# Altium project Solari Cifra 5 - G031.PrjPcb
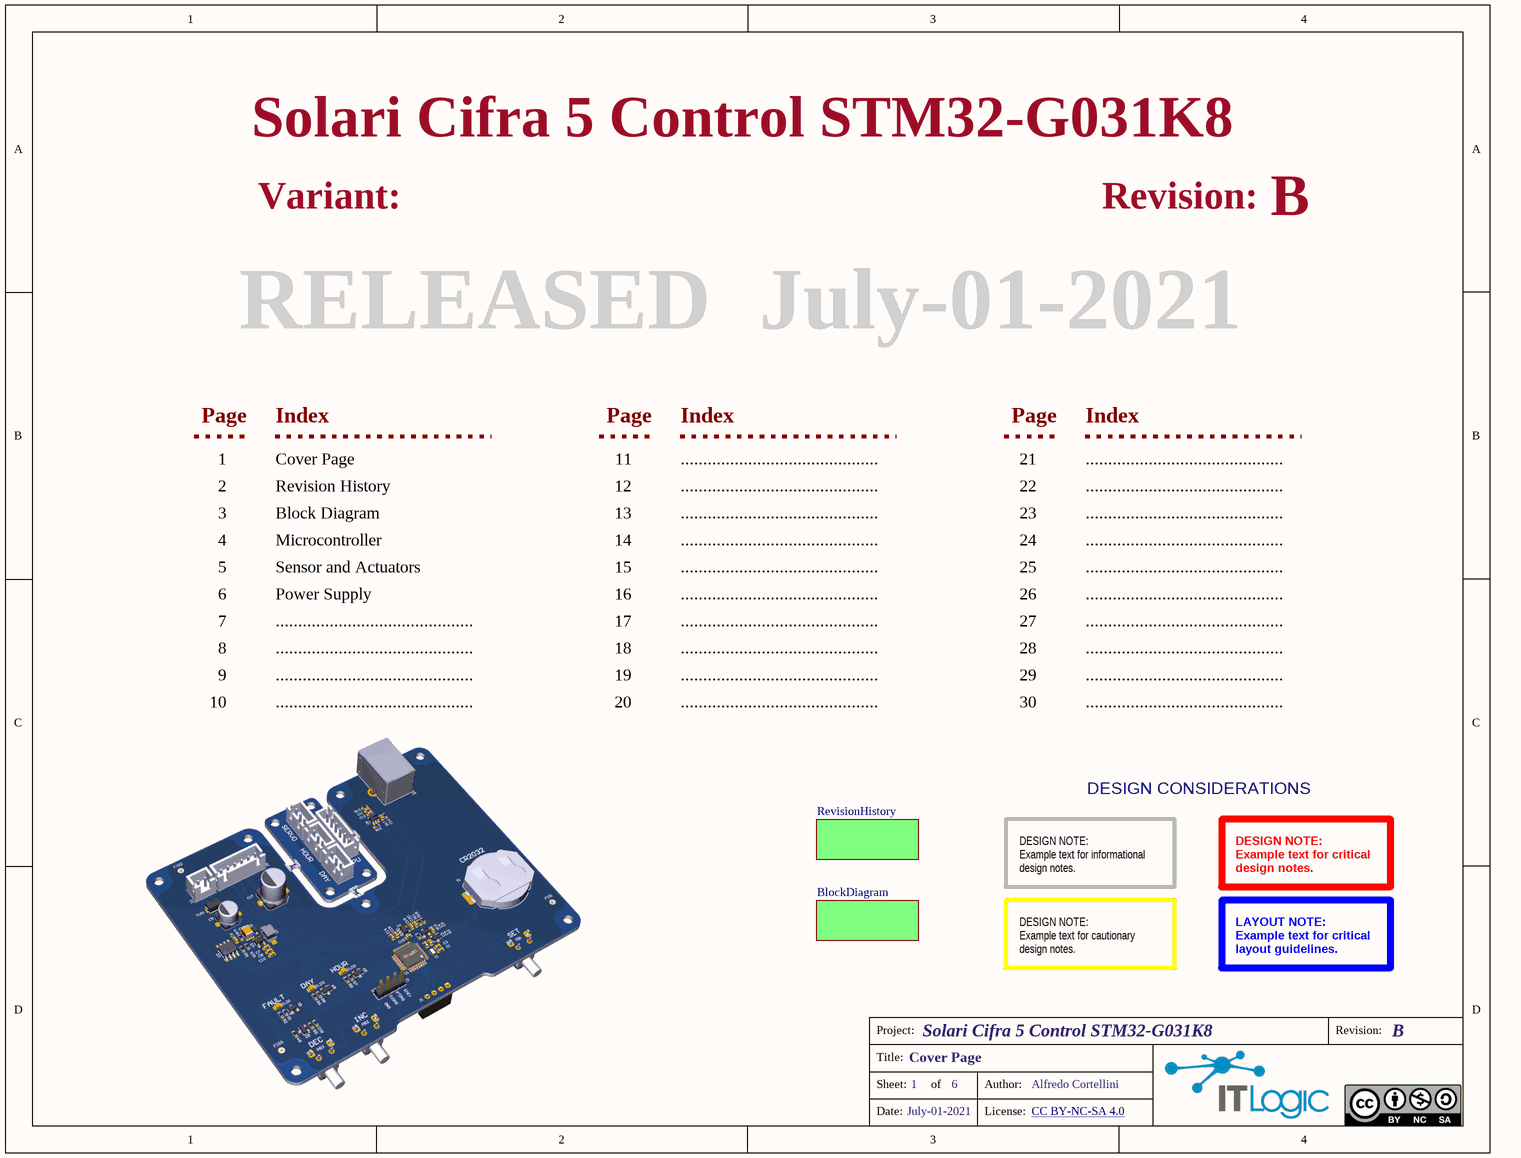
[diagram p0: Cover Page.SchDoc]
VersionRevision: B; ReleaseDate: July-01-2021; ProjectTitle: Solari Cifra 5 Control STM32-G031K8; ProjectCode: SOLC5-G031-B; ProjectAuthor: Alfredo Cortellini
6 sheets, 106 parts. Net scope: flat (ports and power ports of the same name join across sheets).
Board files: PANEL.PcbDoc, SOLC5-G031.PcbDoc
Sheets:
  Cover Page.SchDoc
    RevisionHistory = Revision History.SchDoc
    BlockDiagram = Block Diagram.SchDoc
      Power Supply = Power Supply.SchDoc
      Sensors and Actuators = Sensors and Actuators.SchDoc
      Microcontroller = Microcontroller.SchDoc

## Sheet Cover Page.SchDoc: Cover Page
size Letter; Organization: IT Logic; Address1: 5753 Highway 85 N; Address2: Crestview, FL 32536; Address3: United States; DocumentNumber: 1; SheetNumber: 1; SheetTotal: 6; Email: pcb-design@itlogic.cloud

### Sub-sheets
BlockDiagram = Block Diagram.SchDoc: no entries
RevisionHistory = Revision History.SchDoc: no entries

### Notes on the sheet
- Variant:
- Revision:
- RELEASED
- Page
- Index
- 1
- 2
- Cover Page
- Revision History
- 11
- 12
- ............................................
- 21
- 22
- 3
- 4
- 5
- Microcontroller
- Sensor and Actuators
- Block Diagram
- 13
- 14
- 15
- 23
- 24
- 25
- 6
- 7
- Power Supply
- 16
- 17
- 26
- 27
- 8
- 9
- 10
- 18
- 19
- 20
- 28
- 29
- 30
- DESIGN CONSIDERATIONS
- DESIGN NOTE:
  Example text for informational
  design notes.
- DESIGN NOTE:
  Example text for critical
  design notes.
- DESIGN NOTE:
  Example text for cautionary
  design notes.
- LAYOUT NOTE:
  Example text for critical
  layout guidelines.
- Project:
- Title:
- Sheet:
- of
- Author:
- Date:
- License:
- CC BY-NC-SA 4.0 <https://creativecommons.org/licenses/by-nc-sa/4.0/>

## Sheet Revision History.SchDoc: Revision History
size Letter; Author: Alfredo Cortellini; Organization: IT Logic; Address1: 5753 Highway 85 N; Address2: Crestview, FL 32536; Address3: United States; DocumentNumber: 2; SheetNumber: 2; SheetTotal: 6; Email: pcb-design@itlogic.cloud
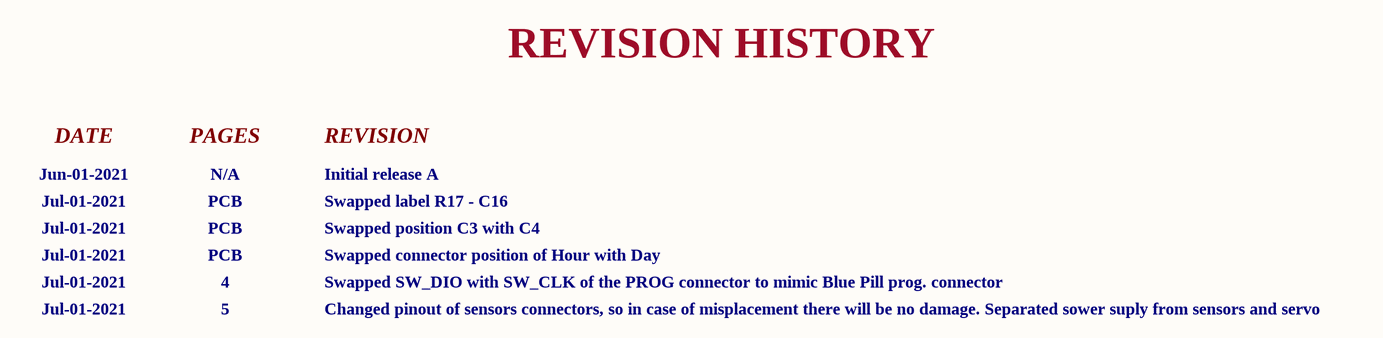
[diagram p1: Revision History.SchDoc]

### Notes on the sheet
- REVISION HISTORY
- Jun-01-2021
- DATE
- N/A
- PAGES
- Initial release A
- REVISION
- Jul-01-2021
- PCB
- Swapped label R17 - C16
- Swapped position C3 with C4
- 4
- 5
- Swapped connector position of Hour with Day
- Swapped SW_DIO with SW_CLK of the PROG connector to mimic Blue Pill prog. connector
- Changed pinout of sensors connectors, so in case of misplacement there will be no damage. Separated sower suply from sensors and servo
- Project:
- Revision:
- Title:
- Sheet:
- of
- Author:
- Date:
- License:
- CC BY-NC-SA 4.0 <https://creativecommons.org/licenses/by-nc-sa/4.0/>

## Sheet Block Diagram.SchDoc: Block Diagram
size Letter; Author: Alfredo Cortellini; Organization: IT Logic; Address1: 5753 Highway 85 N; Address2: Crestview, FL 32536; Address3: United States; DocumentNumber: 3; SheetNumber: 3; SheetTotal: 6; Email: pcb-design@itlogic.cloud
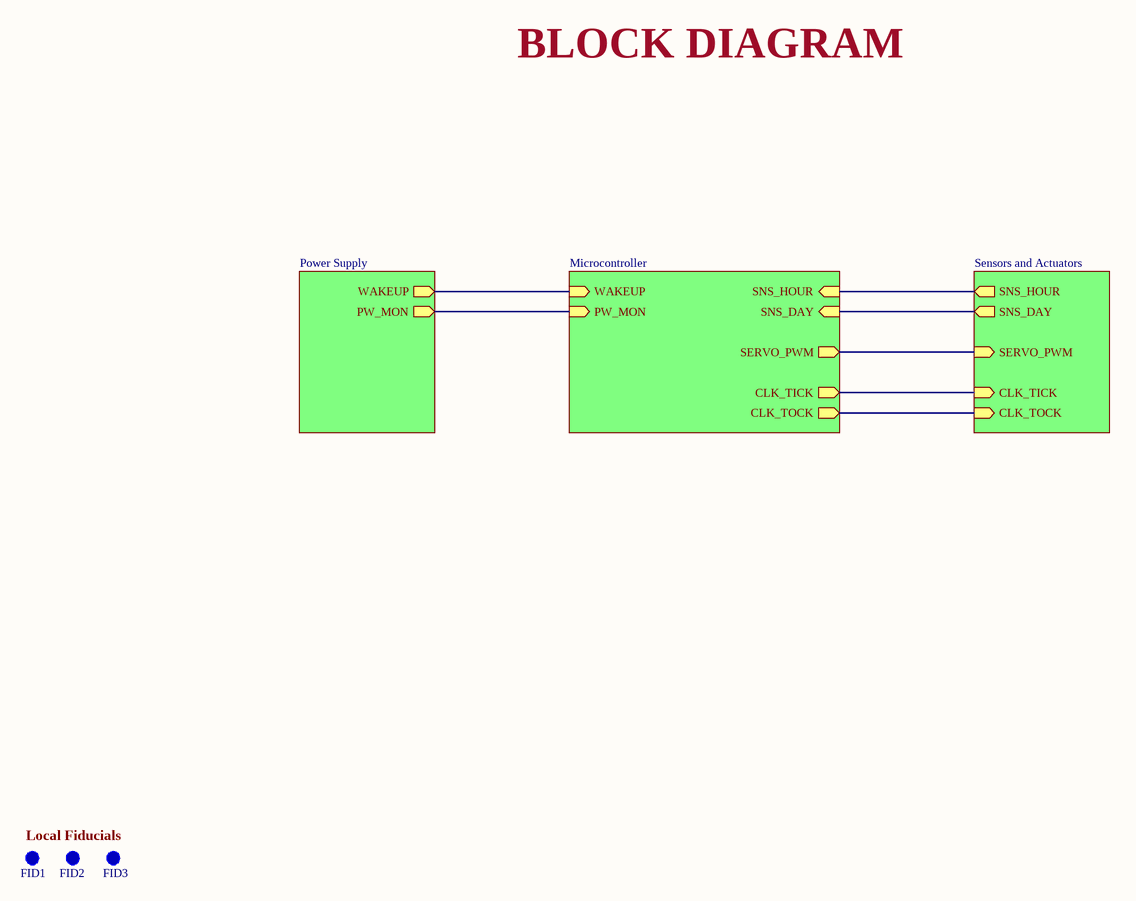
[diagram p2: Block Diagram.SchDoc]

### Parts
FID1  Local Fiducial  [FID-1-2MM]  (value not drawn)
FID2  Local Fiducial  [FID-1-2MM]  (value not drawn)
FID3  Local Fiducial  [FID-1-2MM]  (value not drawn)

### Sub-sheets
Microcontroller = Microcontroller.SchDoc: SNS_HOUR (in), SNS_DAY (in), SERVO_PWM (out), CLK_TICK (out), CLK_TOCK (out), WAKEUP (in), PW_MON (in)
Power Supply = Power Supply.SchDoc: WAKEUP (out), PW_MON (out)
Sensors and Actuators = Sensors and Actuators.SchDoc: SNS_HOUR (out), SNS_DAY (out), SERVO_PWM (in), CLK_TICK (in), CLK_TOCK (in)

### Nets
(unnamed): sheet Power Supply/WAKEUP, sheet Microcontroller/WAKEUP
(unnamed): sheet Power Supply/PW_MON, sheet Microcontroller/PW_MON
(unnamed): sheet Sensors and Actuators/SNS_HOUR, sheet Microcontroller/SNS_HOUR
(unnamed): sheet Sensors and Actuators/SNS_DAY, sheet Microcontroller/SNS_DAY
(unnamed): sheet Sensors and Actuators/SERVO_PWM, sheet Microcontroller/SERVO_PWM
(unnamed): sheet Sensors and Actuators/CLK_TICK, sheet Microcontroller/CLK_TICK
(unnamed): sheet Sensors and Actuators/CLK_TOCK, sheet Microcontroller/CLK_TOCK

### Notes on the sheet
- BLOCK DIAGRAM
- Local Fiducials
- Project:
- Revision:
- Title:
- Sheet:
- of
- Author:
- Date:
- License:
- CC BY-NC-SA 4.0 <https://creativecommons.org/licenses/by-nc-sa/4.0/>

### Library data of the parts
FID1-FID3 = FID-1-2MM: Fiducial 1.0mm Diameter, 2.0mmil Mask

## Sheet Power Supply.SchDoc: Power Supply
size Letter; Author: Alfredo Cortellini; Organization: IT Logic; Address1: 5753 Highway 85 N; Address2: Crestview, FL 32536; Address3: United States; DocumentNumber: 6; SheetNumber: 6; SheetTotal: 6; Email: pcb-design@itlogic.cloud
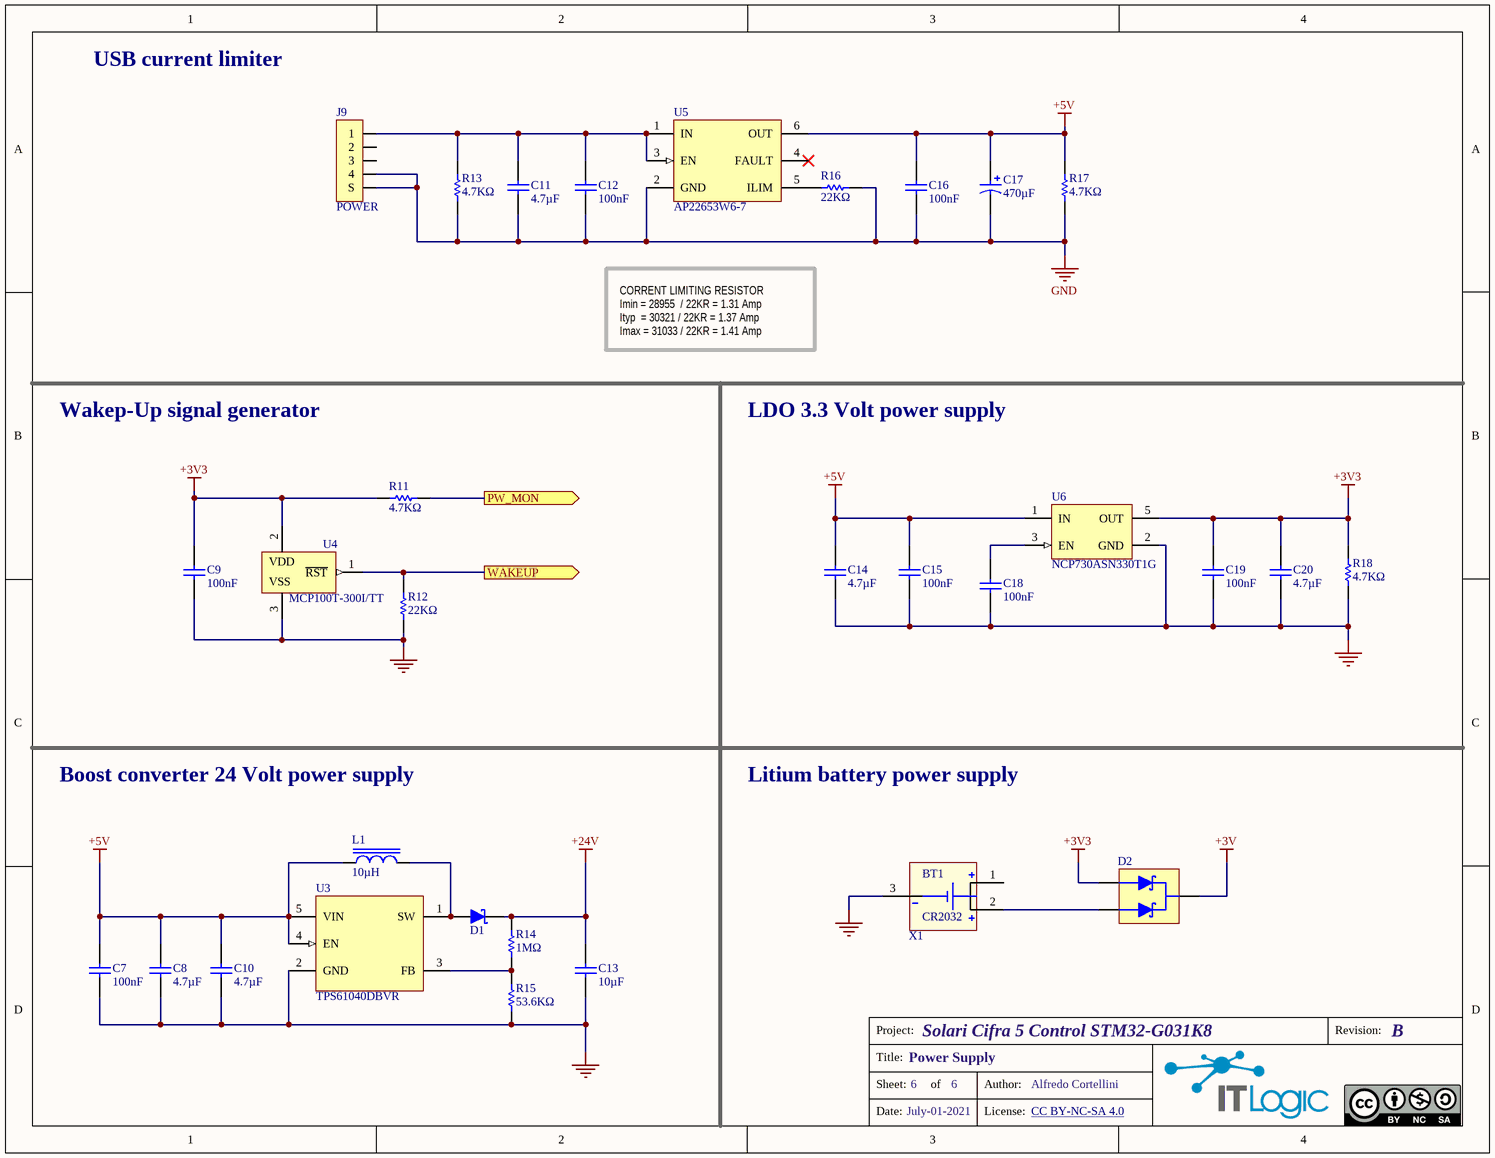
[diagram p3: Power Supply.SchDoc]

### Parts
BT1  CR2032  (mechanical)
C7  100nF  [C0603-H90]
C8  4.7µF  [C0603-H90]
C9  100nF  [C0603-H90]
C10  4.7µF  [C0603-H90]
C11  4.7µF  [C0603-H90]
C12  100nF  [C0603-H90]
C13  10µF  [C1210-H250]
C14  4.7µF  [C0603-H90]
C15  100nF  [C0603-H90]
C16  100nF  [C0603-H90]
C17  470µF  [C-AE-D8-H102]
C18  100nF  [C0603-H90]
C19  100nF  [C0603-H90]
C20  4.7µF  [C0603-H90]
D1  ZLLS400QTC  [SOD-323]  (value not drawn)
D2  BAT5405E6327HTSA1  [SOT-23]  (value not drawn)
J9  POWER  [67068-8000]
L1  10µH  [IND-LQH43CN]
R11  4.7KΩ  [R0603-H55]
R12  22KΩ  [R0603-H55]
R13  4.7KΩ  [R0603-H55]
R14  1MΩ  [R0603-H55]
R15  53.6KΩ  [R0603-H55]
R16  22KΩ  [R0603-H55]
R17  4.7KΩ  [R0603-H55]
R18  4.7KΩ  [R0603-H55]
U3  TPS61040DBVR  [SOT-235]
U4  MCP100T-300I/TT  [SOT-23]
U5  AP22653W6-7  [SOT-236]
U6  NCP730ASN330T1G  [SOT-235]
X1  BAT-HLD-001  [BATT-TRAY-2032]  (value not drawn)

### Ports
PW_MON (out), WAKEUP (out)

### Nets
+3V: D2.3(K)
+3V3: C9.2 C19.2 C20.2 D2.1(A) R11.2 R18.2 U4.2(VDD) U6.5(OUT)
+5V: C7.2 C8.2 C10.2 C14.2 C15.2 C16.2 C17.1 L1.1 R17.2 U3.4(EN) U3.5(VIN) U5.6(OUT) U6.1(IN)
+24V: C13.2 D1.1(K) R14.2
GND: C7.1 C8.1 C9.1 C10.1 C11.1 C12.1 C13.1 C14.1 C15.1 C16.1 C17.2 C18.1 C19.1 C20.1 J9.4 J9.S R12.1 R13.1 R15.1 R16.2 R17.1 R18.1 U3.2(GND) U4.3(VSS) U5.2(GND) U6.2(GND) X1.3(-)
NetC11_2: C11.2 C12.2 J9.1 R13.2 U5.1(IN) U5.3(EN)
NetC18_2: C18.2 U6.3(EN)
NetD1_2: D1.2(A) L1.2 U3.1(SW)
NetD2_2: D2.2(A) X1.2(+)
NetR11_1: R11.1 ; port PW_MON
NetR12_2: R12.2 U4.1(~{RST}) ; port WAKEUP
NetR14_1: R14.1 R15.2 U3.3(FB)
NetR16_1: R16.1 U5.5(ILIM)

Not connected (* = marked no-connect by the designer): J9 2 3; U5 4(FAULT)*; X1 1(+)

### Notes on the sheet
- USB current limiter
- CORRENT LIMITING RESISTOR
  Imin = 28955  / 22KR = 1.31 Amp
  Ityp  = 30321 / 22KR = 1.37 Amp
  Imax = 31033 / 22KR = 1.41 Amp
- Wakep-Up signal generator
- LDO 3.3 Volt power supply
- Boost converter 24 Volt power supply
- Litium battery power supply
- Project:
- Revision:
- Title:
- Sheet:
- of
- Author:
- Date:
- License:
- CC BY-NC-SA 4.0 <https://creativecommons.org/licenses/by-nc-sa/4.0/>

### Library data of the parts
BT1 = CR2032: Battery Lithium 3V Coin 20mm; Manufacturer: Panasonic BSG; Manufacturer Part Number: CR2032; Mount: Free Hanging; Voltage Rating: 3V; ComponentLink1URL: https://datasheet.ciiva.com/2/crseries-datasheets-merged-2903.pdf; ComponentLink1Description: Data Sheet
C7 C9 C12 C15 C16 C18 C19 = CGA3E2X7R1H104K080AA: Cap 0603 Case Ceramic 100nF 50V X7R; Manufacturer: TDK; Value: 100n; Manufacturer Part Number: CGA3E2X7R1H104K080AA; Mount: Surface Mount; Case: 0603; Capacitance: 100nF; Dielectric: X7R; Voltage Rating: 50V; ComponentLink1URL: https://product.tdk.com/system/files/dam/doc/product/capacitor/ceramic/mlcc/catalog/mlcc_commercial_general_en.pdf; ComponentLink1Description: Data Sheet
C8 C10 C11 C14 C20 = C1608X7S1A475K080AC: Cap 0603 Case Ceramic 4.7uF 10V X7S; Manufacturer: TDK; Voltage Rating: 50V; Value: 4.7u; Manufacturer Part Number: C1608X7S1A475K080AC; Mount: Surface Mount; Case: 0603; Capacitance: 4.7uF; Dielectric: X7S; ComponentLink1URL: https://product.tdk.com/system/files/dam/doc/product/capacitor/ceramic/mlcc/catalog/mlcc_commercial_general_en.pdf; ComponentLink1Description: Data Sheet
C13 = CL32B106KBJNNWE: Cap 1210 Case Ceramic 10uF 50V X7R 10%; Manufacturer: Samsung; Dielectric: X7S; Value: 10u; Manufacturer Part Number: CL32B106KBJNNWE; Mount: Surface Mount; Case: 1210; Capacitance: 10uF; Voltage Rating: 50V; ComponentLink1URL: https://www.mouser.com/datasheet/2/585/MLCC-1837944.pdf; ComponentLink1Description: Data Sheet
C17 = EEE-FK1C471P: Cap Electrolytic Alu 470uF 16V 20% (10 X 10.2mm) SMD 600mA 2000h 105C Automotive T/R; Manufacturer: Panasonic; Resistance: 0.16R; Value: 470u; Manufacturer Part Number: EEE-FK1C471P; Mount: Surface Mount; Capacitance: 470uF; Voltage Rating: 16V; ComponentLink1URL: https://datasheet.ciiva.com/3773/41677623s8437994n1386-3773397.pdf; ComponentLink1Description: Data Sheet; Case: F
D1 = ZLLS400QTC: Diode Schottky 40V 0.5A, Vf 480mV, 2-Pin SOD323; Manufacturer: Diodes Incorporated; Manufacturer Part Number: ZLLS400QTC; Mount: Surface Mount; Case: SOD323; Current Rating: 0.5A; ComponentLink1URL: https://eu.mouser.com/datasheet/2/115/ZLLS400Q-959647.pdf; ComponentLink1Description: Data Sheet
D2 = BAT5405E6327HTSA1: Diode Schottky, Common cathode, 40V 0.3A 3-Pin SOT-323; Manufacturer: Infineon Technologies; Manufacturer Part Number: BAT5405E6327HTSA1; Mount: Surface Mount; Case: SOT-23; Current Rating: 0.3A; ComponentLink1URL: https://www.infineon.com/dgdl/Infineon-BAT54SERIES-DS-v01_01-en.pdf?fileId=db3a304314dca3890115190b74210ea6; ComponentLink1Description: Data Sheet
J9 = 67068-8000: Conn USB Type B Right-Angle, Kinked Solder Tabs; Manufacturer: Molex; Voltage Rating: 30V; Current Rating: 1.5A; Manufacturer Part Number: 67068-8000; Mount: Through Hole; ComponentLink1URL: https://www.molex.com/pdm_docs/sd/670688000_sd.pdf; ComponentLink1Description: Data Sheet
L1 = LQH43CN100K03L: Inductor Power LQH43CN Series, 10uH, 0.65 A, 0.24 ohm, SMD; Manufacturer: Murata; Value: 10u; Manufacturer Part Number: LQH43CN100K03L; Inductance: 10µH; ComponentLink1URL: https://search.murata.co.jp/Ceramy/image/img/P02/JELF243A-0042.pdf; ComponentLink1Description: Data Sheet; Mount: Surface Mount
R11 R13 R17 R18 = RC0603FR-074K7L: Resistor 0603 Case 4.7KR 1% 1/10W; Manufacturer: Yageo; Voltage Rating: 150V; Value: 4.7K; Manufacturer Part Number: RC0603FR-074K7L; Case: 0603; Resistance: 4.7kR; ComponentLink1URL: https://datasheet.ciiva.com/11808/0900766b8106beab-11808155.pdf; ComponentLink1Description: Data Sheet; Mount: Surface Mount
R12 R16 = RC0603FR-0722KL: Resistor 0603 Case 22KR 1% 1/10W; Manufacturer: Yageo; Voltage Rating: 150V; Value: 22K; Manufacturer Part Number: RC0603FR-0722KL; Case: 0603; Resistance: 22kR; ComponentLink1URL: https://datasheet.ciiva.com/2457/pyu-r-int-thick-7-2457521.pdf; ComponentLink1Description: Data Sheet; Mount: Surface Mount
R14 = RC0603FR-071ML: Resistor 0603 Case 1MR 1% 1/10W; Manufacturer: Yageo; Voltage Rating: 150V; Value: 1M; Manufacturer Part Number: RC0603FR-071ML; Case: 0603; Resistance: 1MR; ComponentLink1URL: https://datasheet.ciiva.com/2519/pyu-r-int-thick-7-2519712.pdf; ComponentLink1Description: Data Sheet; Mount: Surface Mount
R15 = RC0603FR-0753K6L: Resistor 0603 Case 53.6KR 1% 1/10W; Manufacturer: Yageo; Voltage Rating: 150V; Value: 53.6K; Manufacturer Part Number: RC0603FR-0753K6L; Case: 0603; Resistance: 53.6kR; ComponentLink1URL: https://datasheet.ciiva.com/2457/pyu-r-int-thick-7-2457521.pdf; ComponentLink1Description: Data Sheet; Mount: Surface Mount
U3 = TPS61040DBVR: Conv DC-DC Sync Step-Up 28V .45A 1MHz SOT-23-5; Manufacturer: Texas Instruments; Manufacturer Part Number: TPS61040DBVR; Mount: Surface Mount; Case: STO-235; ComponentLink1URL: http://www.ti.com/lit/ds/symlink/tps54308.pdf; ComponentLink1Description: Data Sheet
U4 = MCP100T-300I/TT: Power Supervisor 3.00V Low SOT23; Manufacturer: Microchip; Manufacturer Part Number: MCP100T-300I/TT; Mount: Surface Mount; Case: SOT-23-3; ComponentLink1URL: https://ww1.microchip.com/downloads/en/DeviceDoc/11187f.pdf; ComponentLink1Description: Data Sheet
U5 = AP22653W6-7: Smart High-Side Power Distribution Switches, 1 Output, 5.5V, Adjustable current limit 2.1A Max, Rdson 65mΩ, SOT-23-6; Manufacturer: Diodes Incorporated; Manufacturer Part Number: AP22653W6-7; Mount: Surface Mount; Case: SOT-23-6; ComponentLink1URL: https://www.diodes.com/assets/Datasheets/AP22652_53_52A_53A.pdf; ComponentLink1Description: Data Sheet
U6 = NCP730ASN330T1G: LDO 3.3V 150mA Out  38Vin 290mV Dropout, Quiescent current 1 uA SOT-23-5; Manufacturer: ON Semiconductor; Manufacturer Part Number: NCP730ASN330T1G; Mount: Surface Mount; Case: SOT-23-5; ComponentLink1URL: https://eu.mouser.com/datasheet/2/308/1/NCP730_D-2317345.pdf; ComponentLink1Description: Data Sheet
X1 = BAT-HLD-001: Holder Battery Coin 20mm; Manufacturer: Linx; Manufacturer Part Number: BAT-HLD-001; Mount: Surface Mount; ComponentLink1URL: https://datasheet.ciiva.com/4/bat-hld-001-4035.pdf; ComponentLink1Description: Data Sheet

## Sheet Sensors and Actuators.SchDoc: Sensors and Actuators
size Letter; Author: Alfredo Cortellini; Organization: IT Logic; Address1: 5753 Highway 85 N; Address2: Crestview, FL 32536; Address3: United States; DocumentNumber: 5; SheetNumber: 5; SheetTotal: 6; Email: pcb-design@itlogic.cloud
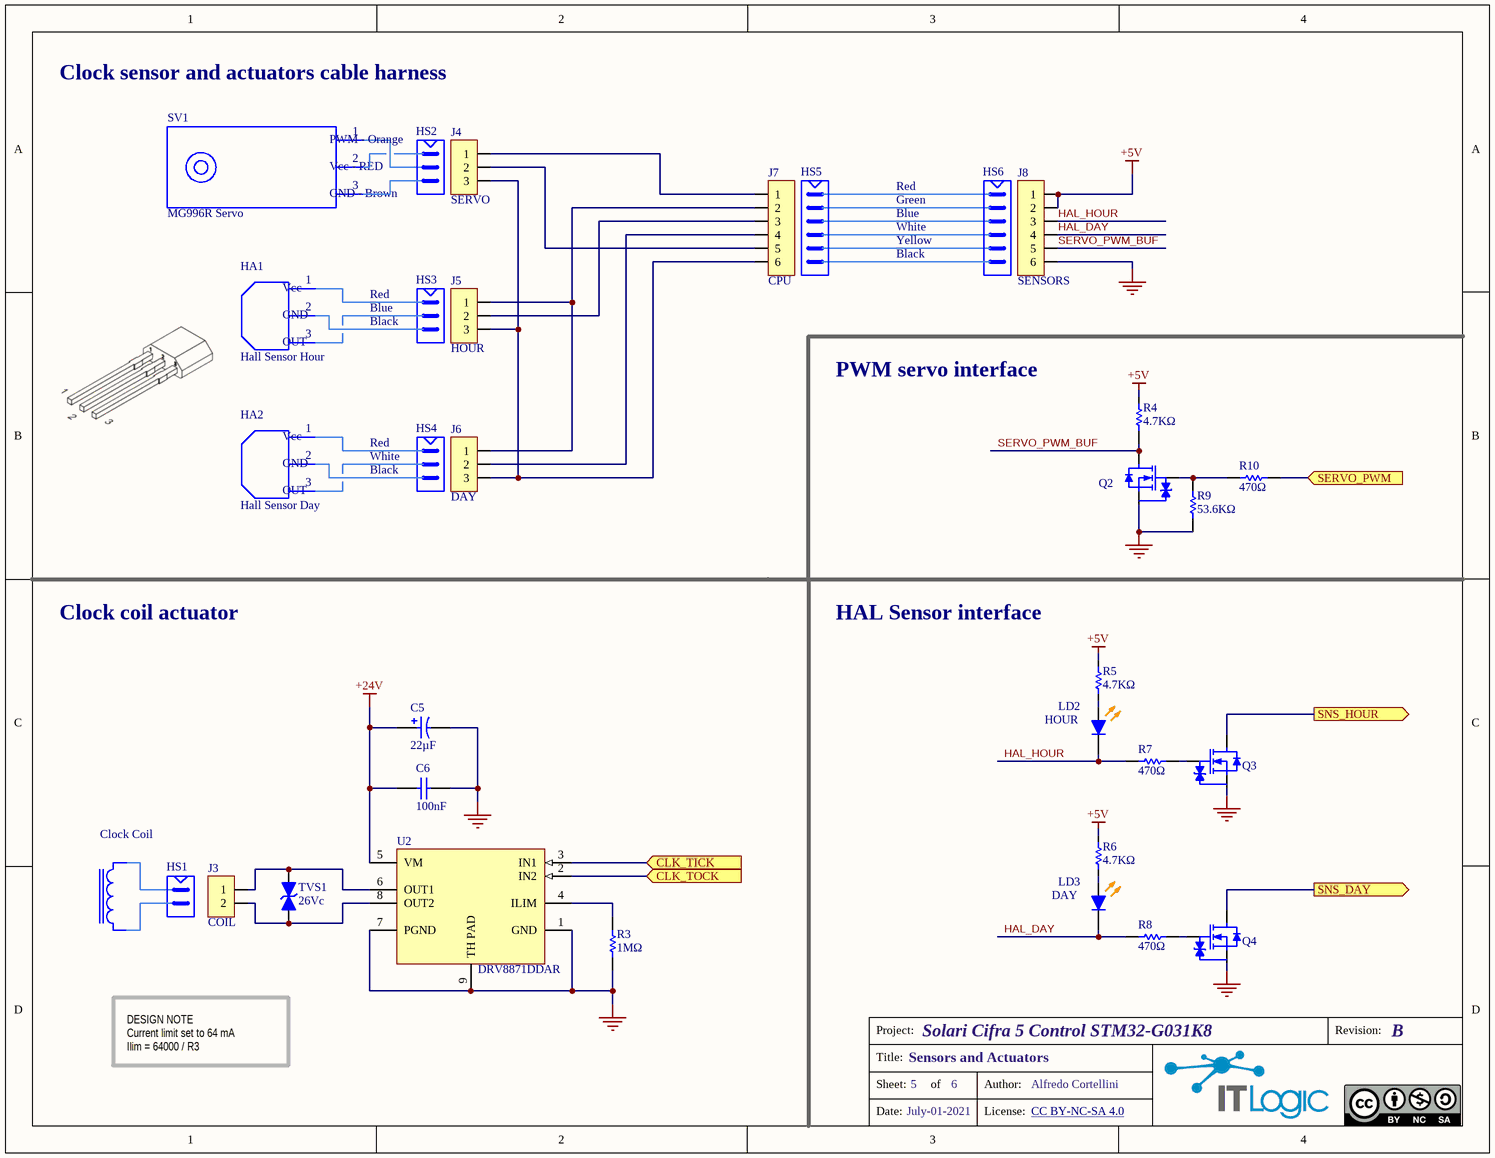
[diagram p4: Sensors and Actuators.SchDoc]

### Parts
C5  22µF  [C-AE-C6-H60]
C6  100nF  [C0603-H90]
HA1  Hall Sensor Hour  (mechanical)
HA2  Hall Sensor Day  (mechanical)
HS1  XHP-2  (value not drawn)  (mechanical)
HS2  XHP-3  (value not drawn)  (mechanical)
HS3  XHP-3  (value not drawn)  (mechanical)
HS4  XHP-3  (value not drawn)  (mechanical)
HS5  XHP-6  (value not drawn)  (mechanical)
HS6  XHP-6  (value not drawn)  (mechanical)
J3  COIL  [JST B2B-XH-A]
J4  SERVO  [JST B3B-XH-A]
J5  HOUR  [JST B3B-XH-A]
J6  DAY  [JST B3B-XH-A]
J7  CPU  [JST B6B-XH-A]
J8  SENSORS  [JST B6B-XH-A]
LD2  HOUR  [LED-0805-O]
LD3  DAY  [LED-0805-O]
Q2  BSS138K-13  [SOT-23]  (value not drawn)
Q3  BSS138K-13  [SOT-23]  (value not drawn)
Q4  BSS138K-13  [SOT-23]  (value not drawn)
R3  1MΩ  [R0603-H55]
R4  4.7KΩ  [R0603-H55]
R5  4.7KΩ  [R0603-H55]
R6  4.7KΩ  [R0603-H55]
R7  470Ω  [R0603-H55]
R8  470Ω  [R0603-H55]
R9  53.6KΩ  [R0603-H55]
R10  470Ω  [R0603-H55]
SV1  MG996R Servo  (mechanical)
TF1  SXH-001T-P0.6  (value not drawn)  (mechanical)
TF2  SXH-001T-P0.6  (value not drawn)  (mechanical)
TF3  SXH-001T-P0.6  (value not drawn)  (mechanical)
TF4  SXH-001T-P0.6  (value not drawn)  (mechanical)
TF5  SXH-001T-P0.6  (value not drawn)  (mechanical)
TF6  SXH-001T-P0.6  (value not drawn)  (mechanical)
TF7  SXH-001T-P0.6  (value not drawn)  (mechanical)
TF8  SXH-001T-P0.6  (value not drawn)  (mechanical)
TF9  SXH-001T-P0.6  (value not drawn)  (mechanical)
TF10  SXH-001T-P0.6  (value not drawn)  (mechanical)
TF11  SXH-001T-P0.6  (value not drawn)  (mechanical)
TF12  SXH-001T-P0.6  (value not drawn)  (mechanical)
TF13  SXH-001T-P0.6  (value not drawn)  (mechanical)
TF14  SXH-001T-P0.6  (value not drawn)  (mechanical)
TF15  SXH-001T-P0.6  (value not drawn)  (mechanical)
TF16  SXH-001T-P0.6  (value not drawn)  (mechanical)
TF17  SXH-001T-P0.6  (value not drawn)  (mechanical)
TF18  SXH-001T-P0.6  (value not drawn)  (mechanical)
TF19  SXH-001T-P0.6  (value not drawn)  (mechanical)
TF20  SXH-001T-P0.6  (value not drawn)  (mechanical)
TF21  SXH-001T-P0.6  (value not drawn)  (mechanical)
TF22  SXH-001T-P0.6  (value not drawn)  (mechanical)
TF23  SXH-001T-P0.6  (value not drawn)  (mechanical)
TVS1  26Vc  [DO-214AC-SMA-NO POL]
U2  DRV8871DDAR  [SOIC-8-N-HT]

### Ports
CLK_TICK (in), CLK_TOCK (in), SERVO_PWM (in), SNS_DAY (out), SNS_HOUR (out)

### Nets
+5V: J8.1 J8.2 R4.2 R5.2 R6.2
+24V: C5.1 C6.1 U2.5(VM)
GND: C5.2 C6.2 J8.6 Q2.2(S) Q3.2(S) Q4.2(S) R3.1 R9.1 U2.1(GND) U2.7(PGND) U2.9(TH_PAD)
HAL_DAY: J8.4 LD3.1(K) R8.1
HAL_HOUR: J8.3 LD2.1(K) R7.1
SERVO_PWM_BUF: J8.5 Q2.3(D) R4.1
NetJ3_1: J3.1 TVS1.2 U2.6(OUT1)
NetJ3_2: J3.2 TVS1.1 U2.8(OUT2)
NetJ4_1: J4.1 J7.1
NetJ4_2: J4.2 J7.5
NetJ4_3: J4.3 J5.3 J6.3 J7.6
NetJ5_1: J5.1 J6.1 J7.2
NetJ5_2: J5.2 J7.3
NetJ6_2: J6.2 J7.4
NetLD2_2: LD2.2(A) R5.1
NetLD3_2: LD3.2(A) R6.1
NetQ2_1: Q2.1(G) R9.2 R10.1
NetQ3_1: Q3.1(G) R7.2
NetQ3_3: Q3.3(D) ; port SNS_HOUR
NetQ4_1: Q4.1(G) R8.2
NetQ4_3: Q4.3(D) ; port SNS_DAY
NetR3_2: R3.2 U2.4(ILIM)
NetR10_2: R10.2 ; port SERVO_PWM
NetU1_13: U2.3(IN1) ; port CLK_TICK
NetU1_14: U2.2(IN2) ; port CLK_TOCK

### Notes on the sheet
- Clock sensor and actuators cable harness
- Blue
- Red
- Green
- White
- Black
- Yellow
- PWM servo interface
- Clock coil actuator
- HAL Sensor interface
- Clock Coil
- DESIGN NOTE
  Current limit set to 64 mA
  Ilim = 64000 / R3
- Project:
- Revision:
- Title:
- Sheet:
- of
- Author:
- Date:
- License:
- CC BY-NC-SA 4.0 <https://creativecommons.org/licenses/by-nc-sa/4.0/>
- (in symbol DRV5023AJQLPG_MEC) 1; Vcc; 2; GND; 3; OUT
- (in symbol MG996R) 1; PWM - Orange; 2; Vcc - RED; 3; GND - Brown

### Library data of the parts
C5 = EEE-FK1H220P: Cap Electrolytic Alu 22uF 50V 20% 165mA 2000h 105C Automotive, Case D; Manufacturer: Panasonic; Resistance: 0.88R; Value: 22u; Manufacturer Part Number: EEE-FK1H220P; Mount: Surface Mount; Capacitance: 22uF; Voltage Rating: 50V; ComponentLink1URL: https://datasheet.ciiva.com/3773/41677623s8437994n1386-3773397.pdf; ComponentLink1Description: Data Sheet; Case: D
C6 = CGA3E2X7R1H104K080AA: as C7 on sheet Power Supply; Manufacturer Part Number: CGA3E2X7R1H104K080AA; Mount: Surface Mount; Case: 0603; Capacitance: 100nF; Dielectric: X7R; Voltage Rating: 50V; ComponentLink1URL: https://product.tdk.com/system/files/dam/doc/product/capacitor/ceramic/mlcc/catalog/mlcc_commercial_general_en.pdf; ComponentLink1Description: Data Sheet
HA1 HA2 = DRV5023AJQLPG_MEC: Hall Effect/Magnetic Sensors 2.5 to 38 V 3-TO-92; Manufacturer: Texas Instruments; Manufacturer Part Number: DRV5023AJQLPG; Case: TO-92; ComponentLink1URL: https://www.ti.com/lit/ds/symlink/drv5023.pdf?ts=1619282643269&ref_url=https%253A%252F%252Fwww.ti.com%252Fsensors%252Fmagnetic-sensors%252Fhall-effect-latches-switches%252Fproducts.html; ComponentLink1Description: Data Sheet; Mount: Through Hole
HS1 = XHP-2: Conn Crimp Housing, Series JST XH, 2 Circuits; Current Rating: 3A; Voltage Rating: 250V; Manufacturer: JST; Manufacturer Part Number: XHP-2; Mount: Free Hanging; ComponentLink1URL: https://www.mouser.com/datasheet/2/276/0050579404_CRIMP_HOUSINGS-160468.pdf; ComponentLink1Description: Data Sheet
HS2-HS4 = XHP-3: Conn Crimp Housing, Series JST XH, 3 Circuits; Current Rating: 3A; Voltage Rating: 250V; Manufacturer: JST; Manufacturer Part Number: XHP-3; Mount: Free Hanging; ComponentLink1URL: https://www.mouser.com/datasheet/2/276/0050579404_CRIMP_HOUSINGS-160468.pdf; ComponentLink1Description: Data Sheet
HS5 HS6 = XHP-6: Conn Crimp Housing, Series JST XH, 6 Circuits; Current Rating: 3A; Voltage Rating: 250V; Manufacturer: JST; Manufacturer Part Number: XHP-6; Mount: Free Hanging; ComponentLink1URL: https://www.mouser.com/datasheet/2/276/0050579404_CRIMP_HOUSINGS-160468.pdf; ComponentLink1Description: Data Sheet
J3 = B2B-XH-A(LF)(SN): Conn Shrouded, Series JST XH, 2 Pos Header,(2.50mm) Through Hole, Vertical Tin; Current Rating: 3A; Voltage Rating: 250V; Manufacturer: JST; Manufacturer Part Number: B2B-XH-A(LF)(SN); Mount: Through Hole; ComponentLink1URL: https://datasheet.ciiva.com/726/exh-726400.pdf; ComponentLink1Description: Data Sheet
J4-J6 = B3B-XH-A(LF)(SN): Conn Shrouded, Series JST XH, 3 Pos Header,(2.50mm) Through Hole, Vertical Tin; Current Rating: 3A; Voltage Rating: 250V; Manufacturer: JST; Manufacturer Part Number: B3B-XH-A(LF)(SN); Mount: Through Hole; ComponentLink1URL: https://datasheet.ciiva.com/726/exh-726400.pdf; ComponentLink1Description: Data Sheet
J7 J8 = B6B-XH-A(LF)(SN): Conn Shrouded, Series JST XH, 6 Pos Header, (2.50mm) Through Hole, Vertical Tin; Current Rating: 3A; Voltage Rating: 250V; Manufacturer: JST; Manufacturer Part Number: B6B-XH-A(LF)(SN); Mount: Through Hole; ComponentLink1URL: https://datasheet.ciiva.com/726/exh-726400.pdf; ComponentLink1Description: Data Sheet
LD2 LD3 = LTST-C170KFKT: LED 0805 Top Orange 605nm 2-Pin; Manufacturer: Vishay Lite-On; Manufacturer Part Number: LTST-C170KFKT; Mount: Surface Mount; Case: 0805; ComponentLink1URL: https://www.mouser.com/datasheet/2/239/Lite-On-LTST-C170KFKT-1175423.pdf; ComponentLink1Description: Data Sheet
Q2-Q4 = BSS138K-13: Mosfet N 50V Vds 20V Vgs ESD 1.4R SOT-23; Manufacturer: Diodes; Manufacturer Part Number: BSS138K-13; Mount: Surface Mount; Case: SOT-23; ComponentLink1Description: Data Sheet; ComponentLink1URL: https://www.diodes.com/assets/Datasheets/BSS138K.pdf
R3 = RC0603FR-071ML: as R14 on sheet Power Supply; Manufacturer Part Number: RC0603FR-071ML; Case: 0603; Resistance: 1MR; ComponentLink1URL: https://datasheet.ciiva.com/2519/pyu-r-int-thick-7-2519712.pdf; ComponentLink1Description: Data Sheet; Mount: Surface Mount
R4-R6 = RC0603FR-074K7L: as R11 on sheet Power Supply; Manufacturer Part Number: RC0603FR-074K7L; Case: 0603; Resistance: 4.7kR; ComponentLink1URL: https://datasheet.ciiva.com/11808/0900766b8106beab-11808155.pdf; ComponentLink1Description: Data Sheet; Mount: Surface Mount
R7 R8 R10 = RC0603FR-07470RL: Resistor 0603 Case 470R 1% 1/10W; Manufacturer: Yageo; Voltage Rating: 150V; Value: 470; Manufacturer Part Number: RC0603FR-07470RL; Case: 0603; Resistance: 470R; ComponentLink1URL: https://datasheet.ciiva.com/11808/0900766b8106beab-11808155.pdf; ComponentLink1Description: Data Sheet; Mount: Surface Mount
R9 = RC0603FR-0753K6L: as R15 on sheet Power Supply; Manufacturer Part Number: RC0603FR-0753K6L; Case: 0603; Resistance: 53.6kR; ComponentLink1URL: https://datasheet.ciiva.com/2457/pyu-r-int-thick-7-2457521.pdf; ComponentLink1Description: Data Sheet; Mount: Surface Mount
SV1 = MG996R: Servo, High Torque, Metal Gear, Dual Ball Bearing, 120 Gegrees, Stall torque: 9.4 kgf·cm (4.8V),; Manufacturer: Jajadeal; Voltage Rating: 3V; Manufacturer Part Number: MG996R; Mount: Free Hanging; ComponentLink1URL: https://datasheetspdf.com/pdf-file/942981/ETC/MG996R/1; ComponentLink1Description: Data Sheet
TF1-TF23 = SXH-001T-P0.6: Crimp Terminal, Series JST XH, Female, 22-28 AWG,; Current Rating: 3A; Voltage Rating: 250V; Manufacturer: JST; Manufacturer Part Number: SXH-001T-P0.6; Mount: Free Hanging; ComponentLink1URL: https://datasheet.ciiva.com/726/exh-726400.pdf; ComponentLink1Description: Data Sheet
TVS1 = SMAJ26CA: TVS Diode Bidirectional 26Vs, 42.1Vc, 9.5 Amp, SMA; Manufacturer: Littelfuse; Manufacturer Part Number: SMAJ26CA; Mount: Surface Mount; ComponentLink1URL: https://datasheet.ciiva.com/332/littelfuse-tvs-diode-smdj-datasheet-pdf-332997.pdf; ComponentLink1Description: Data Sheet; Case: SMA
U2 = DRV8871DDAR: Motor Driver H-bridge 45V, 3.6A, Integrated current sensing SOIC-8 PowerPAD -40 to 125; Manufacturer: Texas Instruments; Manufacturer Part Number: DRV8871DDAR; Mount: Surface Mount; Case: SOIC-8; ComponentLink1URL: https://www.ti.com/lit/ds/symlink/drv8871.pdf?HQS=dis-mous-null-mousermode-dsf-pf-null-wwe&ts=1619428375041&ref_url=https%253A%252F%252Fwww.mouser.it%252F; ComponentLink1Description: Data Sheet

## Sheet Microcontroller.SchDoc: Microcontroller
size Letter; Author: Alfredo Cortellini; Organization: IT Logic; Address1: 5753 Highway 85 N; Address2: Crestview, FL 32536; Address3: United States; DocumentNumber: 4; SheetNumber: 4; SheetTotal: 6; Email: pcb-design@itlogic.cloud
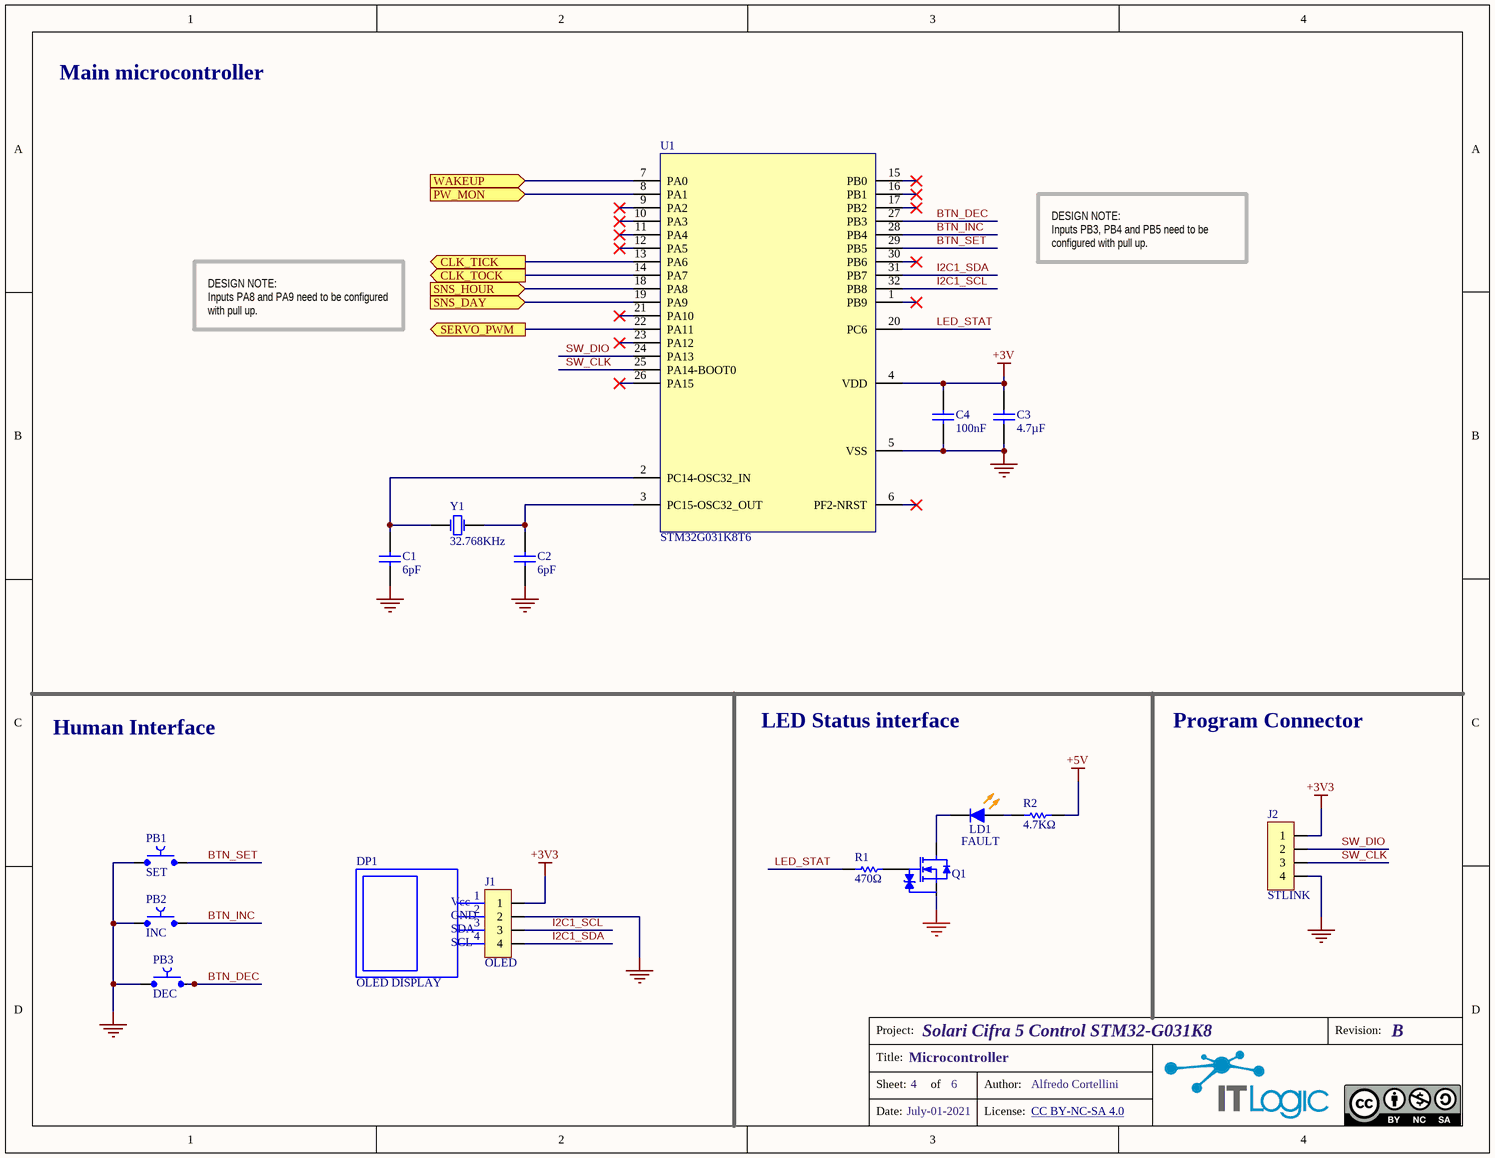
[diagram p5: Microcontroller.SchDoc]

### Parts
C1  6pF  [C0603-H90]
C2  6pF  [C0603-H90]
C3  4.7µF  [C0603-H90]
C4  100nF  [C0603-H90]
DP1  OLED DISPLAY  (mechanical)
J1  OLED  [SSQ-104-01-S-BOTTOM]
J2  STLINK  [HDR-V-1R-04P-5.8L]
LD1  FAULT  [LED-0805-O]
PB1  SET  [BUT-1-1825027-1-BOTTOM]
PB2  INC  [BUT-1-1825027-1-BOTTOM]
PB3  DEC  [BUT-1-1825027-1-BOTTOM]
Q1  BSS138K-13  [SOT-23]  (value not drawn)
R1  470Ω  [R0603-H55]
R2  4.7KΩ  [R0603-H55]
U1  STM32G031K8T6  [LQFP32-7X7-P080]
Y1  32.768KHz  [XTAL-ABM6]

### Ports
CLK_TICK (out), CLK_TOCK (out), PW_MON (in), SERVO_PWM (out), SNS_DAY (in), SNS_HOUR (in), WAKEUP (in)

### Nets
+3V: C3.2 C4.2 U1.4(VDD)
+3V3: J1.1 J2.1
+5V: R2.2
GND: C1.1 C2.1 C3.1 C4.1 J1.2 J2.4 PB1.1 PB2.1 PB3.1 Q1.2(S) U1.5(VSS)
BTN_DEC: PB3.2 U1.27(PB3)
BTN_INC: PB2.2 U1.28(PB4)
BTN_SET: PB1.2 U1.29(PB5)
I2C1_SCL: J1.3 U1.32(PB8)
I2C1_SDA: J1.4 U1.31(PB7)
LED_STAT: R1.1 U1.20(PC6)
SW_CLK: J2.3 U1.25(PA14-BOOT0)
SW_DIO: J2.2 U1.24(PA13)
NetC1_2: C1.2 U1.2(PC14-OSC32_IN) Y1.1(X1)
NetC2_2: C2.2 U1.3(PC15-OSC32_OUT) Y1.2(X2)
NetLD1_1: LD1.1(K) Q1.3(D)
NetLD1_2: LD1.2(A) R2.1
NetQ1_1: Q1.1(G) R1.2
NetQ3_3: U1.18(PA8) ; port SNS_HOUR
NetQ4_3: U1.19(PA9) ; port SNS_DAY
NetR10_2: U1.22(PA11) ; port SERVO_PWM
NetR11_1: U1.8(PA1) ; port PW_MON
NetR12_2: U1.7(PA0) ; port WAKEUP
NetU1_13: U1.13(PA6) ; port CLK_TICK
NetU1_14: U1.14(PA7) ; port CLK_TOCK

Not connected (* = marked no-connect by the designer): U1 1(PB9)* 6(PF2-NRST)* 9(PA2)* 10(PA3)* 11(PA4)* 12(PA5)* 15(PB0)* 16(PB1)* 17(PB2)* 21(PA10)* 23(PA12)* 26(PA15)* 30(PB6)*

### Notes on the sheet
- Main microcontroller
- DESIGN NOTE:
  Inputs PB3, PB4 and PB5 need to be configured with pull up.
- DESIGN NOTE:
  Inputs PA8 and PA9 need to be configured with pull up.
- Human Interface
- LED Status interface
- Program Connector
- Project:
- Revision:
- Title:
- Sheet:
- of
- Author:
- Date:
- License:
- CC BY-NC-SA 4.0 <https://creativecommons.org/licenses/by-nc-sa/4.0/>
- (in symbol MC096VW) 1; Vcc; 2; GND; 3; SDA; 4; SCL

### Library data of the parts
C1 C2 = CGA3E2C0G1H060D080AA: Cap 0603 Case Ceramic 6pF 50V C0G; Manufacturer: TDK; Value: 6p; Manufacturer Part Number: CGA3E2C0G1H060D080AA; Mount: Surface Mount; Case: 0603; Capacitance: 6pF; Dielectric: C0G; Voltage Rating: 50V; ComponentLink1URL: https://product.tdk.com/system/files/dam/doc/product/capacitor/ceramic/mlcc/catalog/mlcc_automotive_general_en.pdf; ComponentLink1Description: Data Sheet
C3 = C1608X7S1A475K080AC: as C8 on sheet Power Supply; Manufacturer Part Number: C1608X7S1A475K080AC; Mount: Surface Mount; Case: 0603; Capacitance: 4.7uF; Dielectric: X7S; ComponentLink1URL: https://product.tdk.com/system/files/dam/doc/product/capacitor/ceramic/mlcc/catalog/mlcc_commercial_general_en.pdf; ComponentLink1Description: Data Sheet
C4 = CGA3E2X7R1H104K080AA: as C7 on sheet Power Supply; Manufacturer Part Number: CGA3E2X7R1H104K080AA; Mount: Surface Mount; Case: 0603; Capacitance: 100nF; Dielectric: X7R; Voltage Rating: 50V; ComponentLink1URL: https://product.tdk.com/system/files/dam/doc/product/capacitor/ceramic/mlcc/catalog/mlcc_commercial_general_en.pdf; ComponentLink1Description: Data Sheet
DP1 = MC096VW: Oled Module, 0.96inch, I2C Interface; Manufacturer: Hiletgo; Voltage Rating: 5V; Manufacturer Part Number: MC096VW; Mount: Through Hole; ComponentLink1URL: https://datasheet.ciiva.com/2/crseries-datasheets-merged-2903.pdf; ComponentLink1Description: Data Sheet
J1 = SSQ-104-01-T-S: Conn Post Socket Header Vert - 1 Row - 4 Pos - 3 mm Lenght - Tin; Manufacturer: Samtec; Current Rating: 3A; Manufacturer Part Number: SSQ-104-01-T-S; Mount: Through Hole; ComponentLink1URL: https://datasheet.ciiva.com/717/eng-cd-146256-g-146256-c-dwg-717712.pdf; ComponentLink1Description: Data Sheet
J2 = 22-28-4043: Breakaway Header Vert - 1 Row - 4 Pos - 6 mm Lenght - Gold; Manufacturer: Molex; Current Rating: 4A; Voltage Rating: 250V; Manufacturer Part Number: 22-28-4043; Mount: Through Hole; ComponentLink1URL: https://datasheet.ciiva.com/6814/022284363-sd-6814049.pdf; ComponentLink1Description: Data Sheet
LD1 = LTST-C170KFKT: as LD2 on sheet Sensors and Actuators; Manufacturer Part Number: LTST-C170KFKT; Mount: Surface Mount; Case: 0805; ComponentLink1URL: https://www.mouser.com/datasheet/2/239/Lite-On-LTST-C170KFKT-1175423.pdf; ComponentLink1Description: Data Sheet
PB1-PB3 = 1-1825027-1: Tactile Switch, Round Stem, Color ivory, Lenght 5.74mm, Right Angle, Through Hole.; Manufacturer: TE Connectivity; Voltage Rating: 24V; Current Rating: 50 mA; Manufacturer Part Number: 1-1825027-1; Mount: Through Hole; ComponentLink1URL: https://www.mouser.com/datasheet/2/418/NG_CD_1825027_G4-659945.pdf; ComponentLink1Description: Data Sheet
Q1 = BSS138K-13: as Q2 on sheet Sensors and Actuators; Manufacturer Part Number: BSS138K-13; Mount: Surface Mount; Case: SOT-23; ComponentLink1Description: Data Sheet; ComponentLink1URL: https://www.diodes.com/assets/Datasheets/BSS138K.pdf
R1 = RC0603FR-07470RL: as R7 on sheet Sensors and Actuators; Manufacturer Part Number: RC0603FR-07470RL; Case: 0603; Resistance: 470R; ComponentLink1URL: https://datasheet.ciiva.com/11808/0900766b8106beab-11808155.pdf; ComponentLink1Description: Data Sheet; Mount: Surface Mount
R2 = RC0603FR-074K7L: as R11 on sheet Power Supply; Manufacturer Part Number: RC0603FR-074K7L; Case: 0603; Resistance: 4.7kR; ComponentLink1URL: https://datasheet.ciiva.com/11808/0900766b8106beab-11808155.pdf; ComponentLink1Description: Data Sheet; Mount: Surface Mount
U1 = STM32G031K8T6: STM32 Arm Cortex-M0+ MCU, 64 Kbytes Flash 8 Kbytes RAM, 64 MHz CPU, Package LQFP32; Manufacturer: STMicroelectronics; Frequency: 64MHz; Manufacturer Part Number: STM32G031K8T6; Mount: Surface Mount; Case: LQFP32; ComponentLink1URL: https://www.st.com/resource/en/datasheet/stm32g031k8.pdf; ComponentLink1Description: Data Sheet
Y1 = ABS06-32.768KHZ-6-1-T: Quartz 32.768kHz ±10ppm Crystal 6pF 90 kOhm -40°C ~ 85°C  Surface Mount 2-SMD; Manufacturer: Abracon; Manufacturer Part Number: ABS06-32.768KHZ-6-1-T; Mount: Surface Mount; Frequency: 32.768kHz; ComponentLink1URL: https://datasheet.ciiva.com/15214/getdatasheetpartid-722402-15214953.pdf; ComponentLink1Description: Data Sheet; Value: 32.768K; Case: ABM6

## Nets that join several sheets
+3V: Power Supply (D2.3), Microcontroller (C3.2 C4.2 U1.4)
+3V3: Power Supply (8 pins), Microcontroller (J1.1 J2.1)
+5V: Power Supply (13 pins), Sensors and Actuators (5 pins), Microcontroller (R2.2)
+24V: Power Supply (C13.2 D1.1 R14.2), Sensors and Actuators (C5.1 C6.1 U2.5)
GND: Power Supply (27 pins), Sensors and Actuators (11 pins), Microcontroller (11 pins)
NetQ3_3: Sensors and Actuators (Q3.3), Microcontroller (U1.18)
NetQ4_3: Sensors and Actuators (Q4.3), Microcontroller (U1.19)
NetR10_2: Sensors and Actuators (R10.2), Microcontroller (U1.22)
NetR11_1: Power Supply (R11.1), Microcontroller (U1.8)
NetR12_2: Power Supply (R12.2 U4.1), Microcontroller (U1.7)
NetU1_13: Sensors and Actuators (U2.3), Microcontroller (U1.13)
NetU1_14: Sensors and Actuators (U2.2), Microcontroller (U1.14)